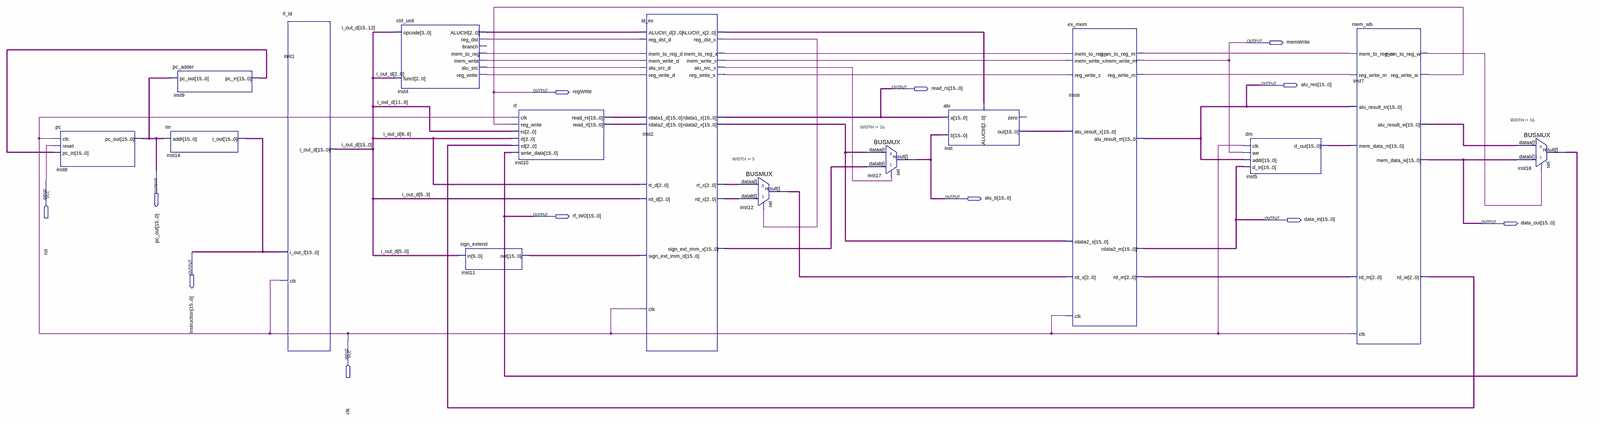
[diagram p0: schematic sheet, whole]
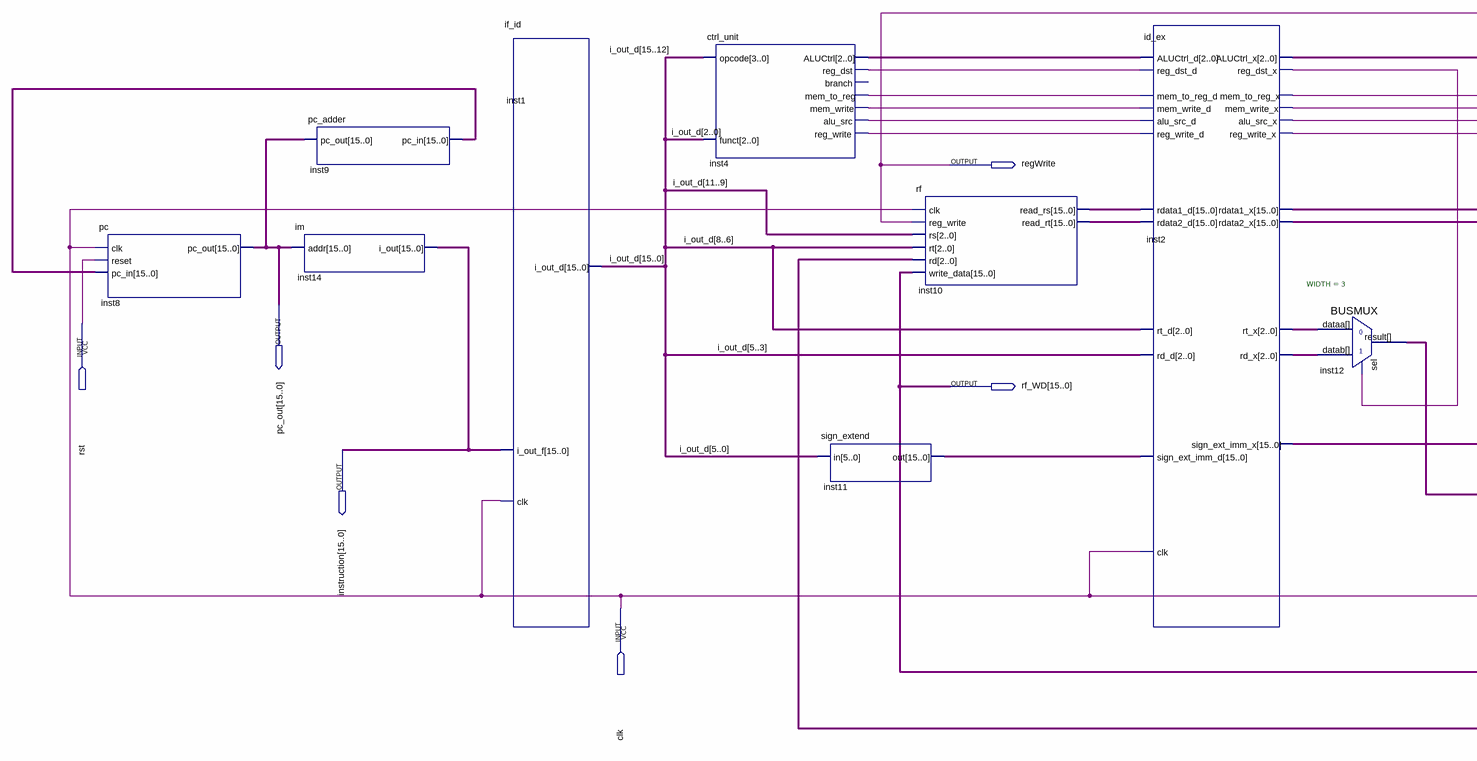
[diagram p1: schematic sheet, left part]
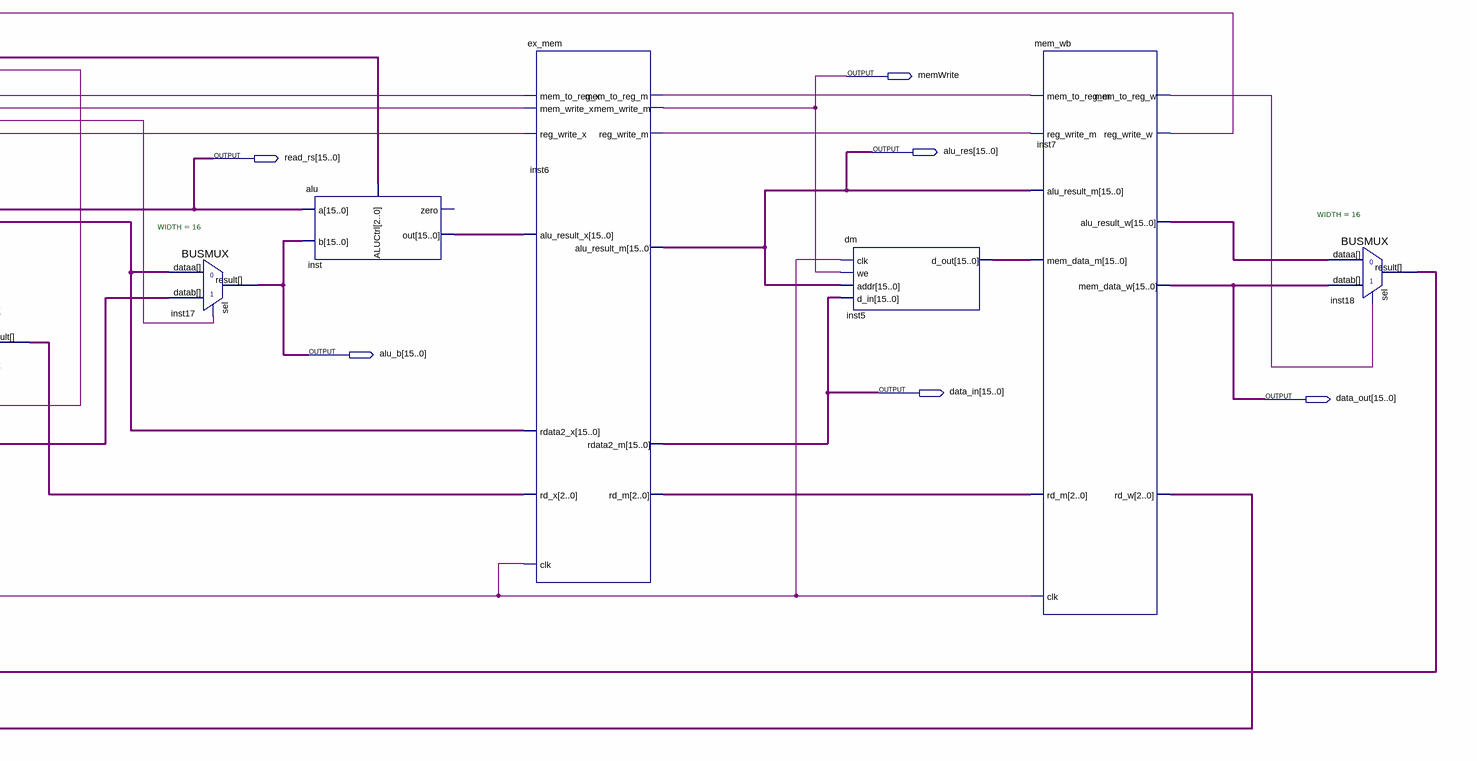
[diagram p2: schematic sheet, right part]
// Quartus schematic processorPipe.bdf as structural Verilog: 15 symbols, 12 pins
module processorPipe (
  input  rst,
  input  clk,
  output memWrite,
  output [15:0] alu_res,
  output [15:0] read_rs,
  output regWrite,
  output [15:0] pc_out,
  output [15:0] alu_b,
  output [15:0] rf_WD,
  output [15:0] data_in,
  output [15:0] data_out,
  output [15:0] instruction
);

  wire inst2_alu_src_x, inst2_mem_to_reg_x, inst2_mem_write_x, inst2_reg_dst_x, inst2_reg_write_x,
       inst4_alu_src, inst4_mem_to_reg, inst4_mem_write, inst4_reg_dst, inst4_reg_write, inst6_mem_to_reg_m,
       inst6_reg_write_m, inst7_mem_to_reg_w;
  wire [2:0] inst2_aluctrl_x, inst2_rd_x, inst2_rt_x, inst4_aluctrl, inst6_rd_m, inst7_rd_w, inst12_result;
  wire [15:0] i_out_d, inst2_rdata2_x, inst2_sign_ext_imm_x, inst5_d_out, inst7_alu_result_w, inst9_pc_in,
       inst10_read_rs, inst10_read_rt, inst11_out, inst_out;

  pc inst8 (.clk(clk), .reset(rst), .pc_in(inst9_pc_in), .pc_out(pc_out));
  pc_adder inst9 (.pc_out(pc_out), .pc_in(inst9_pc_in));
  im inst14 (.addr(pc_out), .i_out(instruction));
  if_id inst1 (.clk(clk), .i_out_f(instruction), .i_out_d(i_out_d));
  ctrl_unit inst4 (
    .opcode(i_out_d[15:12]), .funct(i_out_d[2:0]), .ALUCtrl(inst4_aluctrl), .reg_dst(inst4_reg_dst),
    .mem_to_reg(inst4_mem_to_reg), .mem_write(inst4_mem_write), .alu_src(inst4_alu_src),
    .reg_write(inst4_reg_write));  // open: branch
  sign_extend inst11 (.in(i_out_d[5:0]), .out(inst11_out));
  rf inst10 (
    .clk(clk), .reg_write(regWrite), .rs(i_out_d[11:9]), .rt(i_out_d[8:6]), .rd(inst7_rd_w),
    .write_data(rf_WD), .read_rs(inst10_read_rs), .read_rt(inst10_read_rt));
  id_ex inst2 (
    .clk(clk), .reg_dst_d(inst4_reg_dst), .mem_to_reg_d(inst4_mem_to_reg), .mem_write_d(inst4_mem_write),
    .alu_src_d(inst4_alu_src), .reg_write_d(inst4_reg_write), .rdata1_d(inst10_read_rs),
    .rdata2_d(inst10_read_rt), .sign_ext_imm_d(inst11_out), .rt_d(i_out_d[8:6]), .rd_d(i_out_d[5:3]),
    .ALUCtrl_d(inst4_aluctrl), .reg_dst_x(inst2_reg_dst_x), .mem_to_reg_x(inst2_mem_to_reg_x),
    .mem_write_x(inst2_mem_write_x), .alu_src_x(inst2_alu_src_x), .reg_write_x(inst2_reg_write_x),
    .rdata1_x(read_rs), .rdata2_x(inst2_rdata2_x), .sign_ext_imm_x(inst2_sign_ext_imm_x), .rt_x(inst2_rt_x),
    .rd_x(inst2_rd_x), .ALUCtrl_x(inst2_aluctrl_x));
  BUSMUX #(.WIDTH(3)) inst12 (.datab(inst2_rd_x), .sel(inst2_reg_dst_x), .dataa(inst2_rt_x), .result(inst12_result));
  BUSMUX #(.WIDTH(16)) inst17 (
    .datab(inst2_sign_ext_imm_x), .sel(inst2_alu_src_x), .dataa(inst2_rdata2_x), .result(alu_b));
  alu inst (.a(read_rs), .b(alu_b), .ALUCtrl(inst2_aluctrl_x), .out(inst_out));  // open: zero
  ex_mem inst6 (
    .clk(clk), .mem_to_reg_x(inst2_mem_to_reg_x), .mem_write_x(inst2_mem_write_x),
    .reg_write_x(inst2_reg_write_x), .alu_result_x(inst_out), .rdata2_x(inst2_rdata2_x),
    .rd_x(inst12_result), .mem_to_reg_m(inst6_mem_to_reg_m), .mem_write_m(memWrite),
    .reg_write_m(inst6_reg_write_m), .alu_result_m(alu_res), .rdata2_m(data_in), .rd_m(inst6_rd_m));
  dm inst5 (.clk(clk), .we(memWrite), .addr(alu_res), .d_in(data_in), .d_out(inst5_d_out));
  mem_wb inst7 (
    .clk(clk), .mem_to_reg_m(inst6_mem_to_reg_m), .reg_write_m(inst6_reg_write_m), .alu_result_m(alu_res),
    .mem_data_m(inst5_d_out), .rd_m(inst6_rd_m), .mem_to_reg_w(inst7_mem_to_reg_w), .reg_write_w(regWrite),
    .alu_result_w(inst7_alu_result_w), .mem_data_w(data_out), .rd_w(inst7_rd_w));
  BUSMUX #(.WIDTH(16)) inst18 (.datab(data_out), .sel(inst7_mem_to_reg_w), .dataa(inst7_alu_result_w), .result(rf_WD));
endmodule
